# EasyEDA Pro project TI板第四版MPU6050超声波.epro, board PCB1
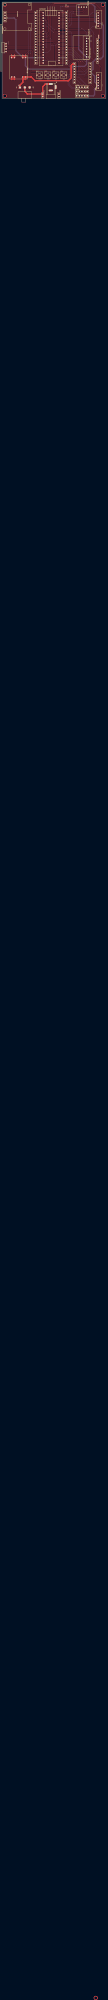
[diagram p1: board, top side]
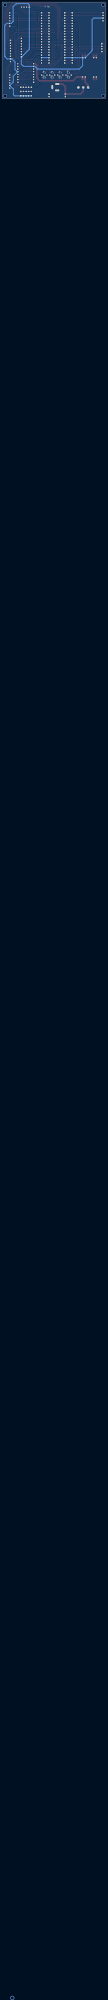
[diagram p2: board, bottom side, seen from below]

Outline 100 x 92.8 mm; copper layers: Top Layer, Bottom Layer. Coordinates in mm from the lower left corner of the outline.
Outline path: rectangle 0,92.8 100,0
Stack: Top Layer 0.035mm / Dielectric1 1.51mm FR4 er 4.5 / Bottom Layer 0.035mm

## Design rules (mm)
template: JLCPCB Capability(Two Layers Board)
spacing copperThickness1oz (default): track to track 0.102, other pairs 0.152 to 0.3
spacing copperThickness2oz: track to track 0.203, other pairs 0.152 to 0.3
track width copperThickness1oz (default): min 0.127, default 0.254, max 2.54
track width copperThickness2oz: min 0.203, default 0.254, max 2.54
differential pair differentialPair (default): width min 0.127, default 0.254, max 2.54; gap min 0.152, default 0.152
via viaSize (default): diameter min 0.5, default 0.61, max 10; hole min 0.3, default 0.305, max 6.3

## Placement (name value [footprint] x y rotation side)
0.96寸OLED  0.96寸OLED  [OLED-TH_L27.8-W27.2-P2.54_C9900033791]  2.79 78.7 90 top
3V3引出  VCC3V3引出  [HDR-TH_5P-P2.54-V-M]  76.9 10.95 180 top
5V引出  5V引出  [HDR-TH_5P-P2.54-V-M]  76.9 2.69 180 top
C23  1uF  [C0603]  36.07 20.41 180 bottom
C24  1uF  [C0603]  59.3 20.39 180 bottom
C25  1uF  [C0603]  43.95 20.4 180 bottom
C26  1uF  [C0603]  51.68 20.39 180 bottom
D2  -  [LED_0603]  62.49 88.64 0 top
DC  -  [DC-005_2.5]  47.22 10.81 270 top
GND  -  [HDR-TH_2P-P2.54-V-F]  54.74 3.13 270 top
GND引出  GND引出  [HDR-TH_5P-P2.54-V-M]  76.9 6.88 180 top
KEY1  KAN0654-0601B  [KEY-TH_L6.0-W6.0-P5.00-LS5.5]  35.96 22.61 0 top
KEY2  KAN0654-0601B  [KEY-TH_L6.0-W6.0-P5.00-LS5.5]  43.96 22.61 0 top
KEY3  KAN0654-0601B  [KEY-TH_L6.0-W6.0-P5.00-LS5.5]  51.7 22.61 0 top
KEY4  KAN0654-0601B  [KEY-TH_L6.0-W6.0-P5.00-LS5.5]  59.32 22.61 0 top
MPU6050-8P  MPU6050-8P  [CONN-TH_8P-P2.54_XH2.54_C9900012080]  81.4 48.96 270 top
MSPM0G3507  LCKFB-DMX-MSPM0G3507  [COMM-TH_L53.3-W22.9-P2.54_LC-DMX-MSPM0G3507]  47.22 58.38 0 top
R7  10kΩ  [R0603]  36.07 24.85 180 bottom
R8  10kΩ  [R0603]  59.31 24.86 180 bottom
R9  10kΩ  [R0603]  43.94 24.83 180 bottom
R10  10kΩ  [R0603]  51.69 24.84 180 bottom
R11  1kΩ  [R0603]  57.4 88.61 0 bottom
SW4  SS-12D06L5  [SW-TH_3P-P4.70_L11.1-W12.7]  21.84 10.75 0 top
U6  ZX-PZ2.54-1-20PZZ  [HDR-TH_20P-P2.54-V-M]  32.45 58.38 270 top
U7  ZX-PZ2.54-1-20PZZ  [HDR-TH_20P-P2.54-V-M]  61.98 58.38 270 top
U11  -  [TB6612]  77.22 24.6 0 top
VCC  -  [HDR-TH_2P-P2.54-V-F]  39.12 3.13 270 top
七路循迹  -  [HDR-TH_9P-P2.54-V-F-1]  91.93 45.81 270 top
电机1  -  [ph2.54]  90.46 67.52 90 top
电机2  -  [ph2.54]  90.46 7.86 90 top
蓝牙模块  -  [HC06]  83.06 90.13 270 top
超声波HC-SR04  HC-SR04  [TH_HC-SR04V]  3.89 49 270 top
降压12转5V  -  [MP1584EN模块_邮票孔]  15.37 29.3 90 top

## Footprints (pads in the part's own frame, mm; a bottom-side part is the same pattern mirrored in y, then rotated)
C0603
  rect 0.8x0.9 smd: 1(-0.7,0) 2(0.7,0)
COMM-TH_L53.3-W22.9-P2.54_LC-DMX-MSPM0G3507
  round 1.8 hole 1: 1(-7.62,24.13) 2(-7.62,21.59) 3(-7.62,19.05) 4(-7.62,16.51) 5(-7.62,13.97) 6(-7.62,11.43) 7(-7.62,8.89) 8(-7.62,6.35) 9(-7.62,3.81) 10(-7.62,1.27) 11(-7.62,-1.27) 12(-7.62,-3.81) 13(-7.62,-6.35) 14(-7.62,-8.89) 15(-7.62,-11.43) 16(-7.62,-13.97) 17(-7.62,-16.51) 18(-7.62,-19.05) 19(-7.62,-21.59) 20(-7.62,-24.13) 21(7.62,-24.13) 22(7.62,-21.59) 23(7.62,-19.05) 24(7.62,-16.51) 25(7.62,-13.97) 26(7.62,-11.43) 27(7.62,-8.89) 28(7.62,-6.35) 29(7.62,-3.81) 30(7.62,-1.27) 31(7.62,1.27) 32(7.62,3.81) 33(7.62,6.35) 34(7.62,8.89) 35(7.62,11.43) 36(7.62,13.97) 37(7.62,16.51) 38(7.62,19.05) 39(7.62,21.59) 40(7.62,24.13)
CONN-TH_8P-P2.54_XH2.54_C9900012080
  round 1.7 hole 1.1: 1(-8.89,0) 2(-6.35,0) 3(-3.81,0) 4(-1.27,0) 5(1.27,0) 6(3.81,0) 7(6.35,0) 8(8.89,0)
DC-005_2.5
  oval 2x4.6 hole 1.2x3.7: 1(-3.227,-0.318) 2(2.973,-0.318)
  oval 4.6x2 hole 3.7x1.2: 3(-0.227,4.382)
HC06
  round 1.5 hole 0.9: 1(2.159,-1.651) 2(2.159,-4.191) 3(2.159,-6.731)
  rect 1.5x1.5 hole 0.9: 4(2.159,-9.271)
HDR-TH_2P-P2.54-V-F
  rect 1.7x1.7 hole 1: 1(-1.27,0)
  round 1.7 hole 1: 2(1.27,0)
HDR-TH_5P-P2.54-V-M
  rect 1.7x1.7 hole 1.1: 1(-5.08,0)
  round 1.7 hole 1.1: 2(-2.54,0) 3(0,0) 4(2.54,0) 5(5.08,0)
HDR-TH_9P-P2.54-V-F-1
  rect 1.7x1.7 hole 1.1: 1(-10.16,0)
  round 1.7 hole 1.1: 2(-7.62,0) 3(-5.08,0) 4(-2.54,0) 5(0,0) 6(2.54,0) 7(5.08,0) 8(7.62,0) 9(10.16,0)
HDR-TH_20P-P2.54-V-M
  rect 1.6x1.6 hole 1.05: 1(-24.13,0)
  round 1.6 hole 1.05: 2(-21.59,0) 3(-19.05,0) 4(-16.51,0) 5(-13.97,0) 6(-11.43,0) 7(-8.89,0) 8(-6.35,0) 9(-3.81,0) 10(-1.27,0) 11(1.27,0) 12(3.81,0) 13(6.35,0) 14(8.89,0) 15(11.43,0) 16(13.97,0) 17(16.51,0) 18(19.05,0) 19(21.59,0) 20(24.13,0)
KEY-TH_L6.0-W6.0-P5.00-LS5.5
  round 1.524 hole 0.914: 1(-2.5,0) 2(2.5,0)
LED_0603
  rect 0.8x0.8 smd: 1(-0.851,-0.01) 2(0.75,-0.005)
MP1584EN模块_邮票孔
  oval 4x2 smd: 1(-9.779,6.096) 1(-9.779,3.556) 2(-9.779,-4.572) 2(-9.779,-7.112) 3(11.303,-4.572) 3(11.303,-7.112) 4(11.303,6.096) 4(11.303,3.556)
  round 1.8 hole 0.9: 1(-8.509,6.096) 1(-8.509,3.556) 2(-8.509,-4.572) 2(-8.509,-7.112) 3(10.033,-4.572) 3(10.033,-7.112) 4(10.033,6.096) 4(10.033,3.556)
OLED-TH_L27.8-W27.2-P2.54_C9900033791
  round 1.8 hole 1.05: 1(-3.81,0) 2(-1.27,0) 3(1.27,0) 4(3.81,0)
ph2.54
  oval 1.4x1.8 hole 0.9: 1(2.2,-2.127) 2(4.74,-2.127) 3(7.28,-2.127) 4(9.82,-2.127) 5(12.36,-2.127) 6(14.9,-2.127)
R0603
  rect 0.806x0.864 smd: 1(-0.753,0) 2(0.753,0)
SW-TH_3P-P4.70_L11.1-W12.7
  rect 2.5x3 hole 1.8: 1(-4.7,0)
  round 3 hole 1.8: 2(0,0) 3(4.7,0)
TB6612
  round 1.575 hole 0.889: 1(-7.62,8.89) 2(-7.62,6.35) 4(-7.62,1.27) 5(-7.62,-1.27) 6(-7.62,-3.81) 7(-7.62,-6.35) 9(7.62,8.89) 10(7.62,6.35) 11(7.62,3.81) 12(7.62,1.27) 13(7.62,-1.27) 14(7.62,-3.81) 15(7.62,-6.35)
  rect 1.575x1.575 hole 0.889: 3(-7.62,3.81) 8(-7.62,-8.89) 16(7.62,-8.89)
TH_HC-SR04V
  rect 1.8x1.8 hole 1.001: 1(-3.81,0)
  round 1.8 hole 1.001: 2(-1.27,0) 3(1.27,0) 4(3.81,0)

## Nets
As in the schematic, except:
$1N7238: D2.1 R11.2

Pads without a net: MPU6050-8P 3 4; SW4 3

## Via types
v1: diameter 4, hole 2.999, Top Layer to Bottom Layer, 5 vias
v2: diameter 0.61, hole 0.305, Top Layer to Bottom Layer, 22 vias

## Routing (per net, layer and track width the routed paths; a pad name or vN(x,y) marks a point on that pad's centre or on a via; arc(x,y) is an arc through that point)
5V: length 7.1
  Bottom Layer w1.27: MSPM0G3507.23 U7.18
+5V: length 349.4
  Top Layer w0.254: D2.2 v2(64.39,88.64)
  Bottom Layer w0.254: v2(64.39,88.64) 71.37,88.64 72.02,87.99 arc(72.04,87.97) 72.06,87.97 73.79,87.97
  Bottom Layer w1.27: 降压12转5V.3 U6.18 MSPM0G3507.18 ; 降压12转5V.3 降压12转5V.3 13.77,45.5 arc(13.4,46.05) 13.27,46.7 13.27,75.84 11.68,77.43 2.79,77.43 ; 降压12转5V.3 22.48,31.58 25.65,28.41 66.04,28.41 68.58,30.95 79.38,30.95 81.34,32.92 81.34,39.93 arc(81.36,40.01) MPU6050-8P.8 arc(81.08,40.13) 80.8,40.32 73.79,47.33 73.79,90.13 74.99,91.34 86.23,91.34 89.38,88.19 89.38,74.13 91.23,72.27 arc(91.24,72.27) 91.25,72.26 电机1.2 95.63,72.26 97.43,70.47 97.43,40.85 arc(97.36,40.52) 97.18,40.24 95.12,38.19 七路循迹.8 90.42,38.19 87.57,35.33 87.57,28.03 85.81,26.27 arc(85.36,25.97) 84.84,25.87 89.15,21.55 89.15,16.6 arc(89.26,16.08) 89.55,15.64 电机2.2 89.07,9.08 arc(89.04,9.03) 89.03,8.98 89.03,3.77 87.88,2.63 82.13,2.63 arc(82.05,2.64) 5V引出.1 5V引出.2 5V引出.3 5V引出.4 5V引出.5
+12V: length 76.1
  Top Layer w1.524: 69.6,33.49 68.23,33.49 arc(68.17,33.48) 68.12,33.44 66.52,31.84 66.52,19.93 63.75,17.17 31.69,17.17 28.07,20.79 降压12转5V.2 降压12转5V.2 19.94,15.71 17.14,12.91 17.14,10.76 arc(17.14,10.76) SW4.1
GND: length 31.6
  Top Layer w0.254: U6.20 MSPM0G3507.20 ; MSPM0G3507.40 U7.1 ; MSPM0G3507.21 U7.20
  Bottom Layer w0.254: GND引出.1 GND引出.2 GND引出.3 GND引出.4 GND引出.5
VCC: length 40.6
  Top Layer w1.524: VCC.1 39.12,11.52 41.66,14.06 46.85,14.06 arc(46.88,14.05) DC.1 ; VCC.1 24.38,4.4 21.84,6.94 SW4.2 ; VCC.1 VCC.2
VCC3V3: length 175.6
  Top Layer w0.254: v2(64.52,30.82) v2(64.52,22.95) ; MSPM0G3507.19 U6.19 arc(32.31,36.88) 32.14,36.92 30.61,36.92 29.69,37.83 arc(29.62,37.94) 29.6,38.06 29.6,45.18 28.7,46.07 26.28,46.07 23.62,43.42 2.44,43.42 1.45,44.41 1.45,51.97 2.29,52.81 超声波HC-SR04.1 ; U7.19 MSPM0G3507.22
  Bottom Layer w0.254: R7.1 38.21,26.24 arc(38.22,26.25) 38.23,26.25 43.69,26.25 44.39,25.54 arc(44.61,25.21) R9.1 48.26,24.83 49.8,26.36 arc(49.81,26.37) 49.83,26.38 51.69,26.38 52.45,25.61 52.45,24.87 arc(52.45,24.85) R10.1 55.37,24.84 56.71,26.18 58.93,26.18 59.93,25.18 arc(60.03,25.03) R8.1 61.59,24.86 63.32,23.14 arc(63.45,22.94) 63.5,22.7 63.5,13.41 67.11,9.8 70.49,9.8 71.49,10.81 arc(71.54,10.85) 71.59,10.88 ; MSPM0G3507.19 MSPM0G3507.22 ; v2(64.52,22.95) 64.52,13.8 67.44,10.88 71.59,10.88 ; 71.59,10.88 arc(71.7,10.93) 3V3引出.5 3V3引出.4 3V3引出.3 3V3引出.2 3V3引出.1 ; U7.19 63.88,36.79 64.52,36.15 v2(64.52,30.82)
(no net):
  vias: v1(2.6,90.2) v1(2.6,2.6) v1(90.2,-1825.97) v1(97.05,90.2) v1(97.05,2.6)
AO1: length 75.5
  Top Layer w0.254: v2(87.25,82.38) 92.49,82.38 arc(92.55,82.39) 电机1.6
  Bottom Layer w0.254: 69.6,25.87 79.5,25.87 82.68,29.04 82.68,36.92 84.52,38.76 84.52,80.48 86.39,82.35 arc(86.43,82.37) 86.47,82.38 v2(87.25,82.38)
AO2: length 64.7
  Bottom Layer w0.254: 69.6,23.33 79.5,23.33 83.38,27.2 83.38,36.66 85.19,38.47 85.19,67.4 87.27,69.48 arc(87.49,69.63) 87.76,69.68 92.49,69.68 arc(92.55,69.69) 电机1.1
BO1: length 32.5
  Top Layer w0.254: v2(78.61,13.55) 88.52,13.55 90.55,15.58 90.55,21.93 91.38,22.76 arc(91.38,22.76) 91.39,22.76 电机2.6
  Bottom Layer w0.254: 76.58,13.55 71.88,18.25 U11.7 ; 76.58,13.55 v2(78.61,13.55)
BO2: length 27.4
  Top Layer w0.254: v2(84.2,12.53) 86.36,12.53 88.84,10.06 92.58,10.06 arc(92.59,10.06) 电机2.1
  Bottom Layer w0.254: U11.6 73.53,20.79 81.79,12.53 84.2,12.53 arc(84.2,12.53) v2(84.2,12.53)
PA0: length 36.8
  Top Layer w0.254: 2.79,82.51 U6.1 MSPM0G3507.1
PA1: length 36.8
  Top Layer w0.254: 0.96寸OLED.3 U6.2 MSPM0G3507.2
PA2: length 76.8
  Top Layer w0.254: v2(49.4,63.46) 86.87,63.46 90.04,60.28 90.04,47.71 arc(90.05,47.69) 90.06,47.68 七路循迹.5 ; MSPM0G3507.6 U6.6
  Bottom Layer w0.254: v2(49.4,63.46) 43.14,69.72 arc(43.04,69.79) 42.93,69.81 MSPM0G3507.6
PA7: length 126.2
  Top Layer w0.254: U6.11 MSPM0G3507.11 arc(39.62,57.1) 39.64,57.09 43.58,57.09 46.13,59.65 46.13,86.29 50.16,90.32 88.58,90.32 94.87,84.03 94.87,56.47 arc(94.85,56.38) 94.79,56.29 七路循迹.2
PA8: length 35.9
  Top Layer w0.254: 超声波HC-SR04.2 30.62,50.27 arc(31.59,50.07) 32.41,49.52 U6.14 MSPM0G3507.14
PA9: length 7.2
  Top Layer w0.254: U6.15 MSPM0G3507.15
PA12: length 44.1
  Top Layer w0.254: U11.14 79.25,20.79 73.22,26.82 73.22,35.71 arc(73.2,35.81) v2(73.14,35.9) ; MSPM0G3507.24 U7.17
  Bottom Layer w0.254: v2(73.14,35.9) 67.19,41.84 arc(67.19,41.86) 67.18,41.87 arc(66.98,42) 66.75,42.05 62.41,42.05 arc(62.17,42) U7.17
PA13: length 42.3
  Top Layer w0.254: MSPM0G3507.25 U7.16 ; 84.84,23.33 81.91,23.33 75.44,29.8 75.44,35.88 arc(75.44,35.89) v2(75.45,35.9)
  Bottom Layer w0.254: U7.16 66.55,44.41 arc(66.91,44.34) 67.21,44.14 v2(75.45,35.9)
PA14: length 37.8
  Top Layer w0.254: 84.84,28.41 77.99,35.25 arc(77.79,35.55) v2(77.72,35.9) ; U7.15 MSPM0G3507.26
  Bottom Layer w0.254: U7.15 66.55,46.95 arc(66.67,46.93) 66.76,46.86 v2(77.72,35.9)
PA15: length 28.3
  Top Layer w0.254: MPU6050-8P.6 77.98,45.15 73.89,49.24 arc(73.61,49.42) 73.28,49.49 U7.14 MSPM0G3507.27
PA16: length 28.4
  Top Layer w0.254: MPU6050-8P.5 77.98,47.69 73.65,52.02 62,52.02 arc(61.99,52.02) U7.13 MSPM0G3507.28
PA17: length 61.8
  Top Layer w0.254: 超声波HC-SR04.3 29.08,47.73 29.58,48.23 40.64,48.23 41.53,49.11 41.53,50.38 42.16,51.02 48.13,51.02 arc(48.13,51.01) v2(48.13,51.01) ; MSPM0G3507.29 U7.12
  Bottom Layer w0.254: v2(48.13,51.01) 51.56,51.01 54.65,54.1 arc(54.79,54.32) MSPM0G3507.29
PA18: length 7.1
  Top Layer w0.254: U7.11 MSPM0G3507.30
PA21: length 52.4
  Top Layer w0.254: 84.84,30.95 v2(79.88,35.9) ; MSPM0G3507.33 U7.8
  Bottom Layer w0.254: v2(79.88,35.9) 67.15,48.64 67.15,62.95 65.39,64.71 62.02,64.71 arc(62,64.72) U7.8
PA22: length 33.7
  Top Layer w0.254: MSPM0G3507.34 U7.7 v2(76.33,67.27)
  Bottom Layer w0.254: v2(76.33,67.27) 77.47,67.27 81.41,63.33 81.41,57.87 arc(81.41,57.86) MPU6050-8P.1
PA23: length 41.3
  Top Layer w0.254: v2(68.83,82.26) 78.14,82.26 arc(78.23,82.27) 78.3,82.32 81.41,85.43 81.41,87.97 ; MSPM0G3507.35 U7.6
  Bottom Layer w0.254: U7.6 64.9,69.81 66.8,71.71 66.8,81.49 67.56,82.26 v2(68.83,82.26)
PA24: length 37
  Top Layer w0.254: 蓝牙模块.2 78.87,85.43 77.53,84.1 arc(77.46,84.05) 77.38,84.03 v2(68.83,84.03) ; U7.5 MSPM0G3507.36
  Bottom Layer w0.254: U7.5 63.75,72.35 65.28,73.87 65.28,82.38 66.93,84.03 v2(68.83,84.03)
PA25: length 37.8
  Top Layer w0.254: MSPM0G3507.37 U7.4 arc(62.07,74.83) 62.18,74.8 电机1.3
PA26: length 37.8
  Top Layer w0.254: 电机1.4 62.18,77.34 arc(62.07,77.37) U7.3 MSPM0G3507.38
PA27: length 18.3
  Top Layer w0.254: MSPM0G3507.39 U7.2
  Bottom Layer w0.254: R11.1 56.65,84.67 60.91,80.41 arc(61.4,80.08) U7.2
PA28: length 87.1
  Top Layer w0.254: U6.3 MSPM0G3507.3 ; v2(86.11,66) v2(50.29,66)
  Bottom Layer w0.254: MSPM0G3507.3 40.77,77.43 41.78,76.41 41.78,74.87 arc(41.85,74.54) 42.04,74.25 v2(50.29,66) ; 七路循迹.7 88.28,44.37 arc(88.27,44.39) 88.26,44.41 88.26,63.59 86.29,65.57 arc(86.15,65.76) v2(86.11,66)
PA31: length 125.3
  Top Layer w0.254: U6.4 MSPM0G3507.4 42.42,74.89 43.43,75.91 43.43,86.83 48.9,92.29 89.53,92.29 97.54,84.29 97.54,48.98 arc(97.52,48.88) 97.46,48.8 七路循迹.6
PB2: length 77.2
  Top Layer w0.254: 84.84,33.49 81.21,37.12 arc(81.07,37.32) 81.03,37.55 arc(80.83,37.68) 80.59,37.73 66.17,37.73 arc(65.98,37.69) 65.82,37.59 63.88,35.65 63.88,33.74 62.36,32.22 53.9,32.22 51.17,34.95 51.17,52.54 49.15,54.57 arc(49.14,54.57) 49.14,54.57 MSPM0G3507.12 U6.12
PB3: length 86.3
  Top Layer w0.254: U6.13 MSPM0G3507.13 48.77,52.03 49.72,51.08 49.72,35.01 53.37,31.36 63.25,31.36 67.1,35.22 70.53,35.22 72.05,33.7 72.05,21.17 74.89,18.33 arc(74.98,18.27) 75.09,18.25 U11.15
PB6: length 134.3
  Top Layer w0.254: v2(46.85,57.74) 46.85,85.82 50.67,89.65 88.29,89.65 94.16,83.78 94.16,58.43 arc(94.11,58.2) 93.98,58 arc(93.96,57.99) 93.94,57.98 七路循迹.1 ; MSPM0G3507.16 U6.16
  Bottom Layer w0.254: MSPM0G3507.16 43.81,44.41 arc(44.17,44.48) 44.47,44.68 46.74,46.95 arc(46.82,47.08) 46.85,47.22 v2(46.85,57.74)
PB7: length 40.5
  Top Layer w0.254: KEY3.2 54.2,26.76 39.97,40.99 arc(39.7,41.4) MSPM0G3507.17 U6.17
  Bottom Layer w0.254: C26.2 52.49,21.9 arc(53.27,22.43) KEY3.2 arc(53.24,22.81) 52.42,23.35 R10.2
PB8: length 74.7
  Top Layer w0.254: MSPM0G3507.31 U7.10 81.41,59.65 arc(81.76,59.58) 82.06,59.38 86.23,55.2 86.23,38.82 arc(86.28,38.59) 86.41,38.39 94.23,30.57 94.23,19.39 arc(94.22,19.33) 94.19,19.28 电机2.4
PB9: length 79.9
  Top Layer w0.254: 电机2.3 94.8,17.35 arc(94.95,17.45) 95.12,17.49 arc(95.26,17.68) 95.3,17.92 95.3,29.95 arc(95.22,30.35) 95,30.69 87,38.69 87,55.59 80.45,62.13 arc(80.38,62.17) 80.3,62.19 U7.9 MSPM0G3507.32
PB18: length 129
  Top Layer w0.254: U6.10 MSPM0G3507.10 43.69,59.65 45.21,61.17 45.21,86.45 49.91,91.15 88.9,91.15 95.76,84.29 95.76,54.95 arc(95.72,54.74) 95.59,54.55 七路循迹.3
PB19: length 130.8
  Top Layer w0.254: 七路循迹.4 96.7,53.12 arc(96.75,53.2) 96.77,53.3 96.77,84.29 89.28,91.78 49.4,91.78 44.45,86.83 44.45,64.35 42.29,62.19 MSPM0G3507.9 U6.9
PB20: length 68.6
  Top Layer w0.254: U6.8 MSPM0G3507.8 ; KEY4.2 56.43,28.01 arc(56.41,28.02) 56.39,28.03 54.61,28.03 42.86,39.77 arc(42.72,39.99) 42.67,40.23 v2(42.67,49.62)
  Bottom Layer w0.254: v2(42.67,49.62) 42.67,63.33 41.28,64.73 MSPM0G3507.8 ; R8.2 60.08,23.34 arc(60.88,22.8) KEY4.2 arc(60.9,22.43) 60.11,21.9 C24.2
PB24: length 79
  Top Layer w0.254: v2(27.5,43.77) 27.5,28.98 29.08,27.39 41.66,27.39 arc(41.68,27.39) 41.7,27.38 KEY2.2 ; U6.7 MSPM0G3507.7
  Bottom Layer w0.254: R9.2 44.65,23.36 arc(45.48,22.81) 46.45,22.61 KEY2.2 arc(45.54,22.43) 44.77,21.91 43.25,20.4 ; v2(27.5,43.77) 27.5,65.36 29.43,67.3 32.37,67.3 arc(32.41,67.29) U6.7
RESET: length 81.2
  Top Layer w0.254: v2(25.72,43.77) 25.72,26.31 27.56,24.47 36.58,24.47 arc(36.6,24.46) 36.63,24.45 KEY1.2 ; MSPM0G3507.5 U6.5
  Bottom Layer w0.254: R7.2 36.91,23.26 arc(37.62,22.78) KEY1.2 arc(37.64,22.45) 36.95,21.99 C23.2 ; v2(25.72,43.77) 25.72,70.16 arc(25.7,70.25) 25.65,70.32 arc(25.7,70.55) 25.83,70.75 27.5,72.41 32.29,72.41 arc(32.38,72.4) U6.5
$1N7238: length 3.5
  Top Layer w0.254: v2(60.45,88.61) 61.58,88.61 arc(61.61,88.61) D2.1
  Bottom Layer w0.254: v2(60.45,88.61) R11.2

## Copper pours and planes (outline as drawn; the poured copper is in the pictures)
GND on Top Layer: -2.92,95.08 101.73,95.08 101.73,-2.07 -2.92,-2.07
GND on Bottom Layer: -2.79,95.72 101.85,95.72 101.85,-2.2 -2.79,-2.2

## Text on the board
Bottom Silkscreen Layer: +5V
Top Silkscreen Layer: ON | OFF | +5V | +3.3V | SDA | SCL | GND | AD0 | RESET | PB24 | PB7 | PA8
